# EAGLE design pi (EAGLE 7.1.0)
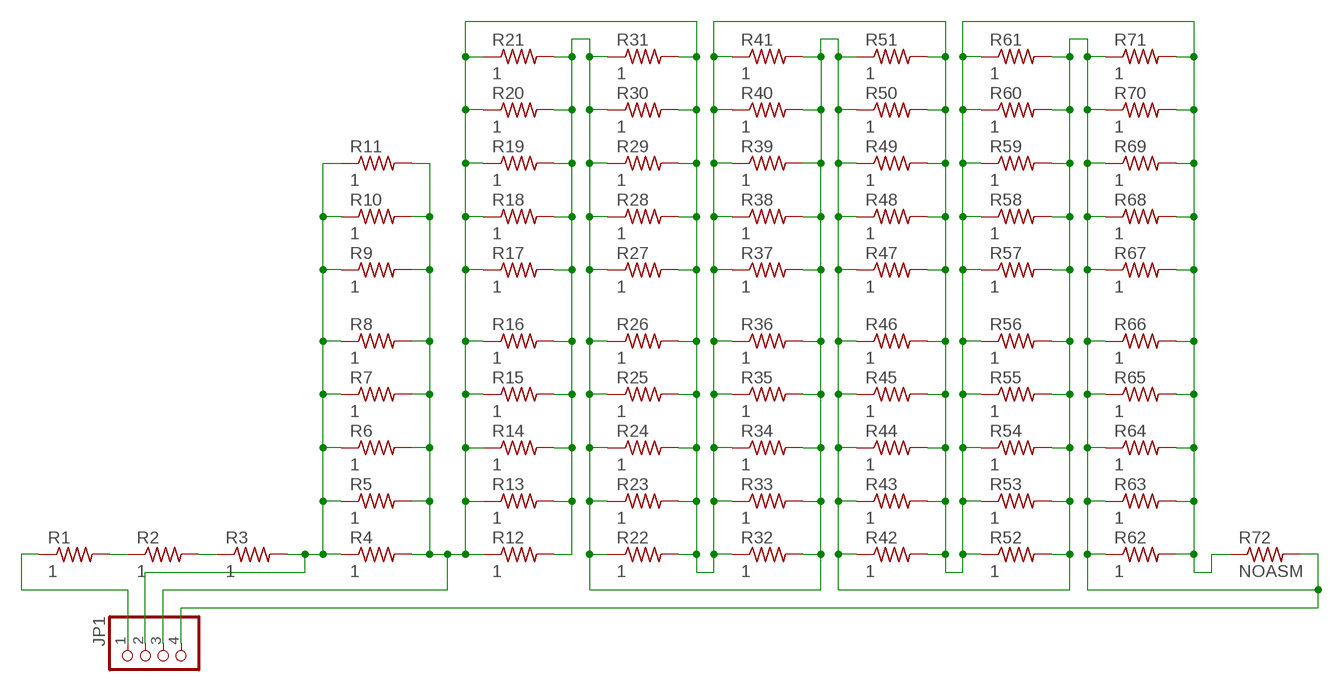
[diagram p0: schematic, sheet 1]

## Parts
JP1  PINHD-1X4  [1X04]
R1  1  R-US_R0603  [R0603]
R2  1  R-US_R0603  [R0603]
R3  1  R-US_R0603  [R0603]
R4  1  R-US_R0603  [R0603]
R5  1  R-US_R0603  [R0603]
R6  1  R-US_R0603  [R0603]
R7  1  R-US_R0603  [R0603]
R8  1  R-US_R0603  [R0603]
R9  1  R-US_R0603  [R0603]
R10  1  R-US_R0603  [R0603]
R11  1  R-US_R0603  [R0603]
R12  1  R-US_R0603  [R0603]
R13  1  R-US_R0603  [R0603]
R14  1  R-US_R0603  [R0603]
R15  1  R-US_R0603  [R0603]
R16  1  R-US_R0603  [R0603]
R17  1  R-US_R0603  [R0603]
R18  1  R-US_R0603  [R0603]
R19  1  R-US_R0603  [R0603]
R20  1  R-US_R0603  [R0603]
R21  1  R-US_R0603  [R0603]
R22  1  R-US_R0603  [R0603]
R23  1  R-US_R0603  [R0603]
R24  1  R-US_R0603  [R0603]
R25  1  R-US_R0603  [R0603]
R26  1  R-US_R0603  [R0603]
R27  1  R-US_R0603  [R0603]
R28  1  R-US_R0603  [R0603]
R29  1  R-US_R0603  [R0603]
R30  1  R-US_R0603  [R0603]
R31  1  R-US_R0603  [R0603]
R32  1  R-US_R0603  [R0603]
R33  1  R-US_R0603  [R0603]
R34  1  R-US_R0603  [R0603]
R35  1  R-US_R0603  [R0603]
R36  1  R-US_R0603  [R0603]
R37  1  R-US_R0603  [R0603]
R38  1  R-US_R0603  [R0603]
R39  1  R-US_R0603  [R0603]
R40  1  R-US_R0603  [R0603]
R41  1  R-US_R0603  [R0603]
R42  1  R-US_R0603  [R0603]
R43  1  R-US_R0603  [R0603]
R44  1  R-US_R0603  [R0603]
R45  1  R-US_R0603  [R0603]
R46  1  R-US_R0603  [R0603]
R47  1  R-US_R0603  [R0603]
R48  1  R-US_R0603  [R0603]
R49  1  R-US_R0603  [R0603]
R50  1  R-US_R0603  [R0603]
R51  1  R-US_R0603  [R0603]
R52  1  R-US_R0603  [R0603]
R53  1  R-US_R0603  [R0603]
R54  1  R-US_R0603  [R0603]
R55  1  R-US_R0603  [R0603]
R56  1  R-US_R0603  [R0603]
R57  1  R-US_R0603  [R0603]
R58  1  R-US_R0603  [R0603]
R59  1  R-US_R0603  [R0603]
R60  1  R-US_R0603  [R0603]
R61  1  R-US_R0603  [R0603]
R62  1  R-US_R0603  [R0603]
R63  1  R-US_R0603  [R0603]
R64  1  R-US_R0603  [R0603]
R65  1  R-US_R0603  [R0603]
R66  1  R-US_R0603  [R0603]
R67  1  R-US_R0603  [R0603]
R68  1  R-US_R0603  [R0603]
R69  1  R-US_R0603  [R0603]
R70  1  R-US_R0603  [R0603]
R71  1  R-US_R0603  [R0603]
R72  NOASM  R-US_R0603  [R0603]

## Nets
N$1: R1.2 R2.1
N$2: R2.2 R3.1
N$4: JP1.4 R12.2 R13.2 R14.2 R15.2 R16.2 R17.2 R18.2 R19.2 R20.2 R21.2 R22.1 R23.1 R24.1 R25.1 R26.1 R27.1 R28.1 R29.1 R30.1 R31.1 R32.2 R33.2 R34.2 R35.2 R36.2 R37.2 R38.2 R39.2 R40.2 R41.2 R42.1 R43.1 R44.1 R45.1 R46.1 R47.1 R48.1 R49.1 R50.1 R51.1 R52.2 R53.2 R54.2 R55.2 R56.2 R57.2 R58.2 R59.2 R60.2 R61.2 R62.1 R63.1 R64.1 R65.1 R66.1 R67.1 R68.1 R69.1 R70.1 R71.1 R72.2
N$5: JP1.1 R1.1
N$6: JP1.2 R3.2 R4.1 R5.1 R6.1 R7.1 R8.1 R9.1 R10.1 R11.1
N$7: JP1.3 R4.2 R5.2 R6.2 R7.2 R8.2 R9.2 R10.2 R11.2 R12.1 R13.1 R14.1 R15.1 R16.1 R17.1 R18.1 R19.1 R20.1 R21.1 R22.2 R23.2 R24.2 R25.2 R26.2 R27.2 R28.2 R29.2 R30.2 R31.2 R32.1 R33.1 R34.1 R35.1 R36.1 R37.1 R38.1 R39.1 R40.1 R41.1 R42.2 R43.2 R44.2 R45.2 R46.2 R47.2 R48.2 R49.2 R50.2 R51.2 R52.1 R53.1 R54.1 R55.1 R56.1 R57.1 R58.1 R59.1 R60.1 R61.1 R62.2 R63.2 R64.2 R65.2 R66.2 R67.2 R68.2 R69.2 R70.2 R71.2 R72.1

## Library data of the parts
JP1 = pinhead:PINHD-1X4: PIN HEADER
R1-R72 = resistor:R-US_: RESISTOR, American symbol

## Board
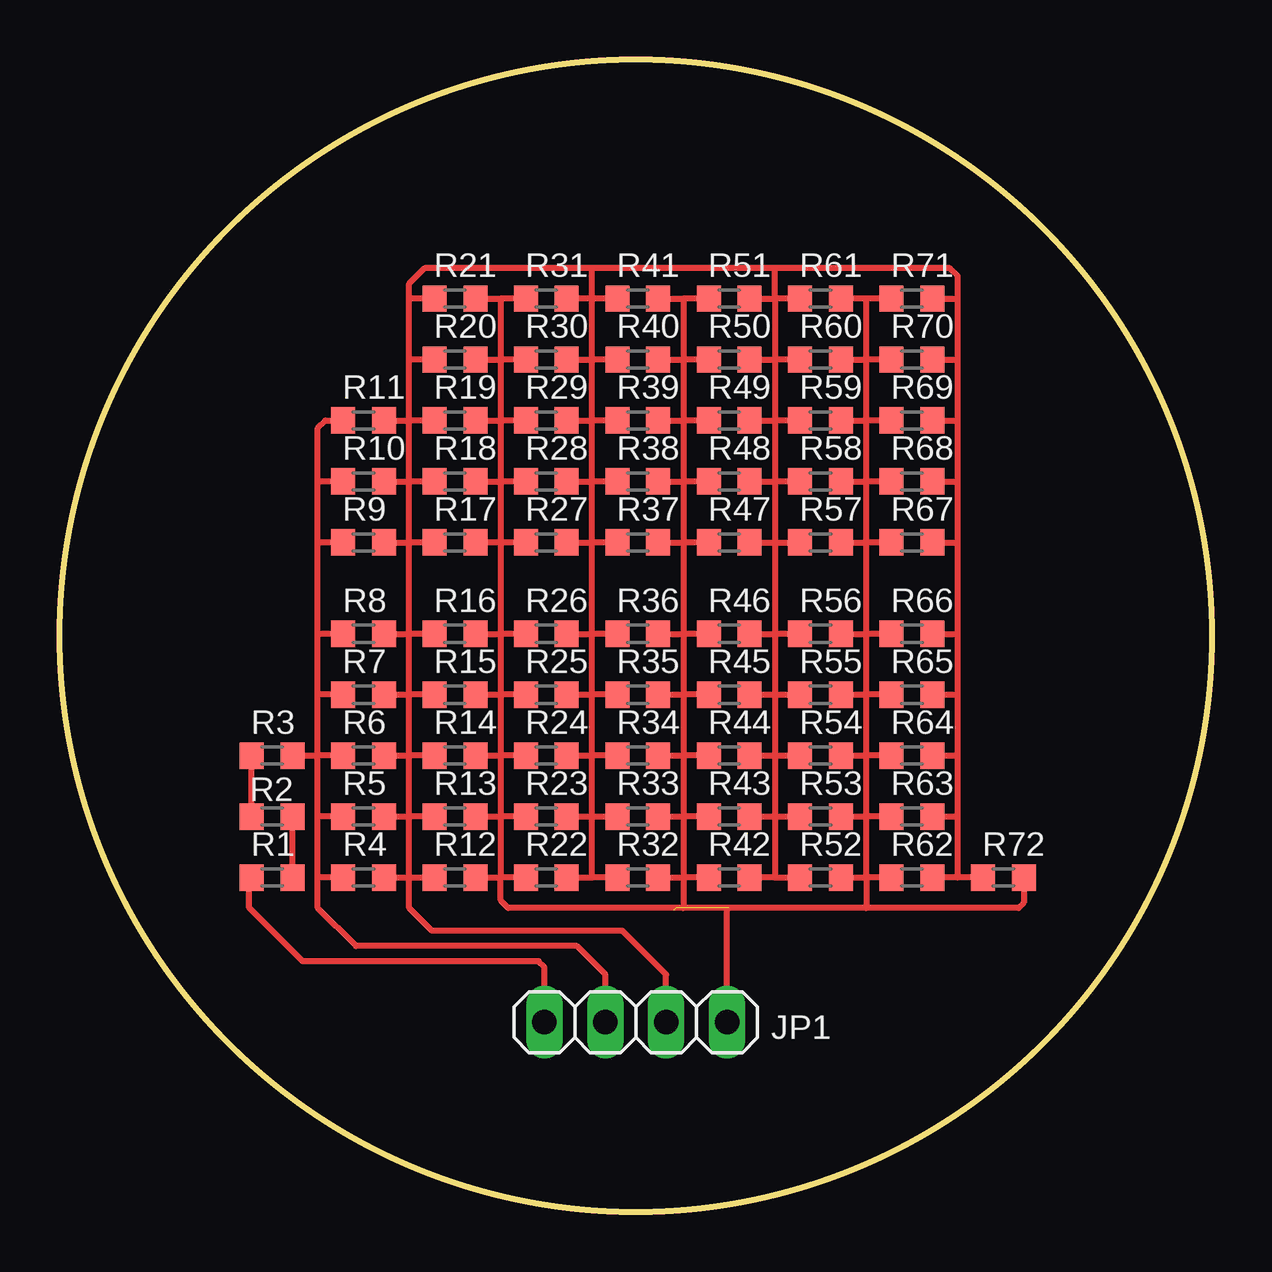
[diagram p1: board, top side]

Size 48 x 48 mm. Coordinates in mm from the lower left corner, seen from the top.
Outline: circle at 24,24 radius 24
Copper layers (1*16): Top 0.035mm / dielectric 1.5mm / Bottom 0.035mm
Design rules "Elecrow_2-layer_eagle_rule": minimum track width 6mil, minimum drill 12mil, track to track 6mil, track to pad 6mil, pad to pad 6mil, via to via 6mil, smd to smd 0mil, copper to edge 10mil, drill to drill 10mil, minimum pad ring 10mil, minimum via ring 6mil, stop-mask expansion 2mil, vias tented up to drill 100mil, thermal gap 10mil

### Footprints (pad centres in the part's own frame; a part is rotated, then mirrored left to right if it is on the bottom)
1X04 = drill 1.016 long: 1 -3.81,0; 2 -1.27,0; 3 1.27,0; 4 3.81,0
R0603 = smd 1 x 1.1: 1 -0.85,0; 2 0.85,0

### Placement (x,y rotation side)
JP1  24,7.89 0 top
R1  8.84,13.92 0 top
R2  8.84,16.46 180 top
R3  8.84,19 0 top
R4  12.65,13.92 0 top
R5  12.65,16.46 0 top
R6  12.65,19 0 top
R7  12.65,21.54 0 top
R8  12.65,24.08 0 top
R9  12.65,27.89 0 top
R10  12.65,30.43 0 top
R11  12.65,32.97 0 top
R12  16.46,13.92 0 top
R13  16.46,16.46 0 top
R14  16.46,19 0 top
R15  16.46,21.54 0 top
R16  16.46,24.08 0 top
R17  16.46,27.89 0 top
R18  16.46,30.43 0 top
R19  16.46,32.97 0 top
R20  16.46,35.51 0 top
R21  16.46,38.05 0 top
R22  20.27,13.92 0 top
R23  20.27,16.46 0 top
R24  20.27,19 0 top
R25  20.27,21.54 0 top
R26  20.27,24.08 0 top
R27  20.27,27.89 0 top
R28  20.27,30.43 0 top
R29  20.27,32.97 0 top
R30  20.27,35.51 0 top
R31  20.27,38.05 0 top
R32  24.08,13.92 0 top
R33  24.08,16.46 0 top
R34  24.08,19 0 top
R35  24.08,21.54 0 top
R36  24.08,24.08 0 top
R37  24.08,27.89 0 top
R38  24.08,30.43 0 top
R39  24.08,32.97 0 top
R40  24.08,35.51 0 top
R41  24.08,38.05 0 top
R42  27.89,13.92 0 top
R43  27.89,16.46 0 top
R44  27.89,19 0 top
R45  27.89,21.54 0 top
R46  27.89,24.08 0 top
R47  27.89,27.89 0 top
R48  27.89,30.43 0 top
R49  27.89,32.97 0 top
R50  27.89,35.51 0 top
R51  27.89,38.05 0 top
R52  31.7,13.92 0 top
R53  31.7,16.46 0 top
R54  31.7,19 0 top
R55  31.7,21.54 0 top
R56  31.7,24.08 0 top
R57  31.7,27.89 0 top
R58  31.7,30.43 0 top
R59  31.7,32.97 0 top
R60  31.7,35.51 0 top
R61  31.7,38.05 0 top
R62  35.51,13.92 0 top
R63  35.51,16.46 0 top
R64  35.51,19 0 top
R65  35.51,21.54 0 top
R66  35.51,24.08 0 top
R67  35.51,27.89 0 top
R68  35.51,30.43 0 top
R69  35.51,32.97 0 top
R70  35.51,35.51 0 top
R71  35.51,38.05 0 top
R72  39.32,13.92 0 top

### Tracks (layer width: path | path; a pad name or v marks a point on that pad's centre or on a via)
N$1
  Top 0.254: R1.2 R2.1
N$2
  Top 0.254: R2.2 R3.1
N$4  (3 unrouted)
  Top 0.254: 24.72,38.05 R41.2 25.99,38.05 | R31.1 18.37,38.05 | 18.37,38.05 18.37,35.51 | 18.37,35.51 18.37,32.97 | 18.37,32.97 18.37,30.43 | 18.37,30.43 18.37,27.89 | 18.37,27.89 18.37,24.08 | 18.37,24.08 18.37,21.54 | 18.37,21.54 18.37,19 | 18.37,19 18.37,16.46 | 18.37,16.46 18.37,13.92 | R12.2 18.37,13.92 | R22.1 18.37,13.92 | 18.37,27.89 R17.2 | R27.1 18.37,27.89 | R21.2 18.37,38.05 | R20.2 18.37,35.51 | R30.1 18.37,35.51 | R29.1 18.37,32.97 | R19.2 18.37,32.97 | R18.2 18.37,30.43 | R28.1 18.37,30.43 | R16.2 18.37,24.08 | R26.1 18.37,24.08 | R25.1 18.37,21.54 | R15.2 18.37,21.54 | R14.2 18.37,19 | R24.1 18.37,19 | R23.1 18.37,16.46 | R13.2 18.37,16.46 | 25.99,38.05 25.99,35.51 | 25.99,35.51 25.99,32.97 | 25.99,32.97 25.99,30.43 | 25.99,30.43 25.99,27.89 | 25.99,27.89 25.99,24.08 | 25.99,24.08 25.99,21.54 | 25.99,21.54 25.99,19 | 25.99,19 25.99,16.46 | 25.99,16.46 25.99,13.92 | R40.2 25.99,35.51 | R39.2 25.99,32.97 | R38.2 25.99,30.43 | R37.2 25.99,27.89 | R36.2 25.99,24.08 | R35.2 25.99,21.54 | R34.2 25.99,19 | R32.2 25.99,13.92 | R33.2 25.99,16.46 | R42.1 25.99,13.92 | R43.1 25.99,16.46 | R44.1 25.99,19 | R45.1 25.99,21.54 | R46.1 25.99,24.08 | R47.1 25.99,27.89 | R48.1 25.99,30.43 | R49.1 25.99,32.97 | R50.1 25.99,35.51 | R51.1 25.99,38.05 | R52.2 33.61,13.92 | 33.61,12.65 27.89,12.65 | 33.61,13.92 33.61,12.65 | R72.2 40.17,12.87 39.96,12.65 33.61,12.65 | 33.61,13.92 33.61,16.46 | 33.61,16.46 33.61,19 | 33.61,19 33.61,21.54 | 33.61,21.54 33.61,24.08 | 33.61,24.08 33.61,27.89 | 33.61,27.89 33.61,30.43 | 33.61,30.43 33.61,32.97 | 33.61,32.97 33.61,35.51 | 33.61,35.51 33.61,38.05 | 33.61,38.05 R61.2 | R60.2 33.61,35.51 | R59.2 33.61,32.97 | R58.2 33.61,30.43 | R57.2 33.61,27.89 | R56.2 33.61,24.08 | R55.2 33.61,21.54
  Top 0.254: R54.2 33.61,19 | R53.2 33.61,16.46 | R62.1 33.61,13.92 | R63.1 33.61,16.46 | R64.1 33.61,19 | R65.1 33.61,21.54 | R66.1 33.61,24.08 | R67.1 33.61,27.89 | R69.1 33.61,32.97 | R68.1 33.61,30.43 | R70.1 33.61,35.51 | R71.1 33.61,38.05 | 27.89,12.65 25.99,12.65 | 25.99,12.65 18.68,12.65 18.37,12.97 18.37,13.92 | JP1.4 27.81,12.57 27.89,12.65 | 25.99,13.92 25.99,12.65
N$5
  Top 0.254: JP1.1 20.19,10.2 19.95,10.43 10.11,10.43 7.89,12.65 7.89,13.82 R1.1
N$6
  Top 0.254: 10.75,13.92 10.75,12.65 12.34,11.06 21.54,11.06 22.73,9.88 JP1.2 | 10.75,13.92 10.75,16.46 | 10.75,16.46 10.75,19 | 10.75,19 10.75,21.54 | 10.75,21.54 10.75,24.08 | 10.75,24.08 10.75,27.89 | 10.75,27.89 10.75,30.43 | 10.75,30.43 10.75,32.66 11.06,32.97 R11.1 | R10.1 10.75,30.43 | R9.1 10.75,27.89 | R8.1 10.75,24.08 | R7.1 10.75,21.54 | R6.1 10.75,19 | R3.2 10.75,19 | R5.1 10.75,16.46 | R4.1 10.75,13.92
N$7
  Top 0.254: 14.56,13.92 14.56,12.65 15.51,11.7 23.45,11.7 25.27,9.88 JP1.3 | 14.56,13.92 14.56,16.46 | 14.56,16.46 14.56,19 | 14.56,19 14.56,21.54 | 14.56,21.54 14.56,24.08 | 14.56,24.08 14.56,27.89 | 14.56,27.89 14.56,30.43 | 14.56,30.43 14.56,32.97 | 14.56,32.97 14.56,35.51 | 14.56,35.51 14.56,38.05 | 14.56,38.05 14.56,38.69 15.19,39.32 22.18,39.32 | R4.2 14.56,13.92 | 14.56,13.92 R12.1 | R20.1 14.56,35.51 | R21.1 14.56,38.05 | R11.2 14.56,32.97 | R10.2 14.56,30.43 | R9.2 14.56,27.89 | R8.2 14.56,24.08 | R7.2 14.56,21.54 | R6.2 14.56,19 | R5.2 14.56,16.46 | R13.1 14.56,16.46 | R14.1 14.56,19 | R15.1 14.56,21.54 | R16.1 14.56,24.08 | R17.1 14.56,27.89 | R18.1 14.56,30.43 | R19.1 14.56,32.97 | R41.1 22.18,38.05 | 22.18,38.05 22.18,39.32 | 22.18,38.05 R31.2 | R22.2 22.18,13.92 | 22.18,13.92 22.18,16.46 | 22.18,16.46 22.18,19 | 22.18,19 22.18,21.54 | 22.18,21.54 22.18,24.08 | 22.18,24.08 22.18,27.89 | 22.18,27.89 22.18,30.43 | 22.18,30.43 22.18,32.97 | 22.18,32.97 22.18,35.51 | 22.18,35.51 22.18,38.05 | R30.2 22.18,35.51 | R40.1 22.18,35.51 | R39.1 22.18,32.97 | R29.2 22.18,32.97 | R28.2 22.18,30.43 | R38.1 22.18,30.43 | R37.1 22.18,27.89 | R27.2 22.18,27.89 | R26.2 22.18,24.08 | R36.1 22.18,24.08 | R35.1 22.18,21.54 | R25.2 22.18,21.54 | R24.2 22.18,19 | R34.1 22.18,19 | R23.2 22.18,16.46 | 22.18,16.46 R33.1 | R32.1 22.18,13.92 | R51.2 29.8,38.05 | 29.8,38.05 29.8,39.32 | 29.8,39.32 22.18,39.32 | 29.8,38.05 29.8,35.51 | 29.8,35.51 29.8,32.97 | 29.8,32.97 29.8,30.43 | 29.8,30.43 29.8,27.89 | 29.8,27.89 29.8,24.08 | 29.8,24.08 29.8,21.54 | 29.8,21.54 29.8,19 | 29.8,19 29.8,16.46 | 29.8,16.46 29.8,13.92 | 29.8,13.92 R42.2 | R43.2 29.8,16.46 | R44.2 29.8,19 | R45.2 29.8,21.54 | R46.2 29.8,24.08 | R47.2 29.8,27.89 | R48.2 29.8,30.43
  Top 0.254: R49.2 29.8,32.97 | R50.2 29.8,35.51 | R61.1 29.8,38.05 | R60.1 29.8,35.51 | R59.1 29.8,32.97 | R58.1 29.8,30.43 | 29.8,27.89 R57.1 | R56.1 29.8,24.08 | 29.8,21.54 R55.1 | 29.8,19 R54.1 | 29.8,16.46 R53.1 | 29.8,13.92 R52.1 | R71.2 37.42,38.05 | 37.42,38.05 37.42,39.01 37.1,39.32 29.8,39.32 | R72.1 37.42,13.92 | 37.42,13.92 37.42,16.46 | 37.42,16.46 37.42,19 | 37.42,19 37.42,21.54 | 37.42,21.54 37.42,24.08 | 37.42,24.08 37.42,27.89 | 37.42,27.89 37.42,30.43 | 37.42,30.43 37.42,32.97 | 37.42,32.97 37.42,35.51 | 37.42,35.51 37.42,38.05 | 37.42,13.92 R62.2 | R63.2 37.42,16.46 | R64.2 37.42,19 | R65.2 37.42,21.54 | R66.2 37.42,24.08 | R67.2 37.42,27.89 | R68.2 37.42,30.43 | R69.2 37.42,32.97 | R70.2 37.42,35.51